# EAGLE design cgrid-cat5-adapter (EAGLE 4.16)
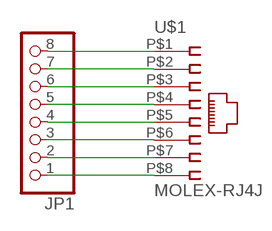
[diagram p0: schematic, sheet 1]

## Parts
JP1  PINHD-1X8_2.54  [1X08]
U$1  MOLEX-RJ4J  [MOLEX-RJ45]

## Nets
N$1: JP1.8 U$1.P$1
N$2: JP1.7 U$1.P$2
N$3: JP1.6 U$1.P$3
N$4: JP1.5 U$1.P$4
N$5: JP1.4 U$1.P$5
N$6: JP1.3 U$1.P$6
N$7: JP1.2 U$1.P$7
N$8: JP1.1 U$1.P$8

## Library data of the parts
JP1 = pinhead-1:PINHD-1X8: PIN HEADER
U$1 = con-rj45:MOLEX-RJ4J

## Board
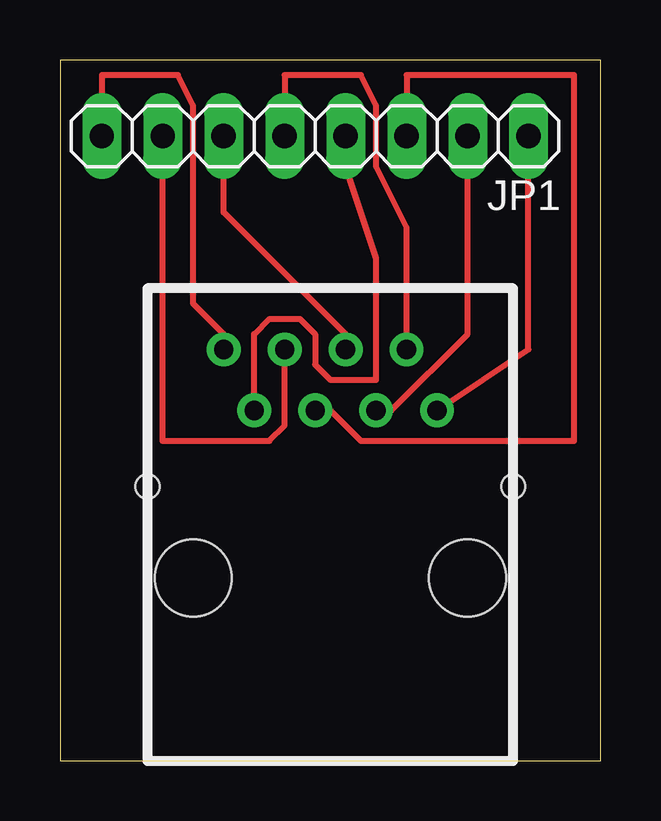
[diagram p1: board, top side]

Size 22.53 x 29.2 mm. Coordinates in mm from the lower left corner, seen from the top.
Outline: 0,0 22.53,0 22.53,29.2 0,29.2 0,0
Copper layers (1*16): Top 0.035mm / dielectric 1.5mm / Bottom 0.035mm
Design rules "dave": minimum track width 12mil, minimum drill 24mil, track to track 12mil, track to pad 12mil, pad to pad 12mil, via to via 12mil, smd to smd 8mil, copper to edge 40mil, drill to drill 12mil, minimum pad ring 12mil, minimum via ring 12mil, stop-mask expansion 4mil, vias tented up to drill 0mil, thermal gap 10mil

### Footprints (pad centres in the part's own frame; a part is rotated, then mirrored left to right if it is on the bottom)
1X08 = drill 1.016 long: 1 -8.89,0; 2 -6.35,0; 3 -3.81,0; 4 -1.27,0; 5 1.27,0; 6 3.81,0; 7 6.35,0; 8 8.89,0
MOLEX-RJ45 = drill 0.8 round: P$1 -3.81,2.54; P$2 -1.27,2.54; P$3 1.27,2.54; P$4 3.81,2.54; P$5 -2.54,0; P$6 0,0; P$7 2.54,0; P$8 5.08,0 | hole 3.2: -5.08,-6.985; 6.35,-6.985 | hole 1: -6.985,-3.175; 8.255,-3.175

### Placement (x,y rotation side)
JP1  10.63,26.03 180 top
U$1  10.63,14.6 0 top

### Tracks (layer width: path | path; a pad name or v marks a point on that pad's centre or on a via)
N$1
  Top 0.254: U$1.P$1 6.82,17.77 5.55,19.04 5.55,27.3 4.92,28.57 1.74,28.57 JP1.8
N$2
  Top 0.254: U$1.P$2 9.36,13.97 8.72,13.33 4.28,13.33 JP1.7
N$3
  Top 0.254: U$1.P$3 11.9,17.77 6.82,22.86 JP1.6
N$4
  Top 0.254: U$1.P$4 14.44,22.22 13.17,24.76 13.17,27.3 12.54,28.57 9.36,28.57 JP1.5
N$5
  Top 0.254: U$1.P$5 8.09,17.77 8.72,18.41 9.99,18.41 10.63,17.77 10.63,16.5 11.26,15.87 13.17,15.87 13.17,20.95 11.9,24.76 JP1.4
N$6
  Top 0.254: U$1.P$6 11.26,14.6 12.54,13.33 21.43,13.33 21.43,28.57 14.44,28.57 JP1.3
N$7
  Top 0.254: U$1.P$7 13.8,14.6 16.98,17.77 JP1.2
N$8
  Top 0.254: U$1.P$8 19.52,17.14 JP1.1